# EAGLE design counter (EAGLE 9.1.0)
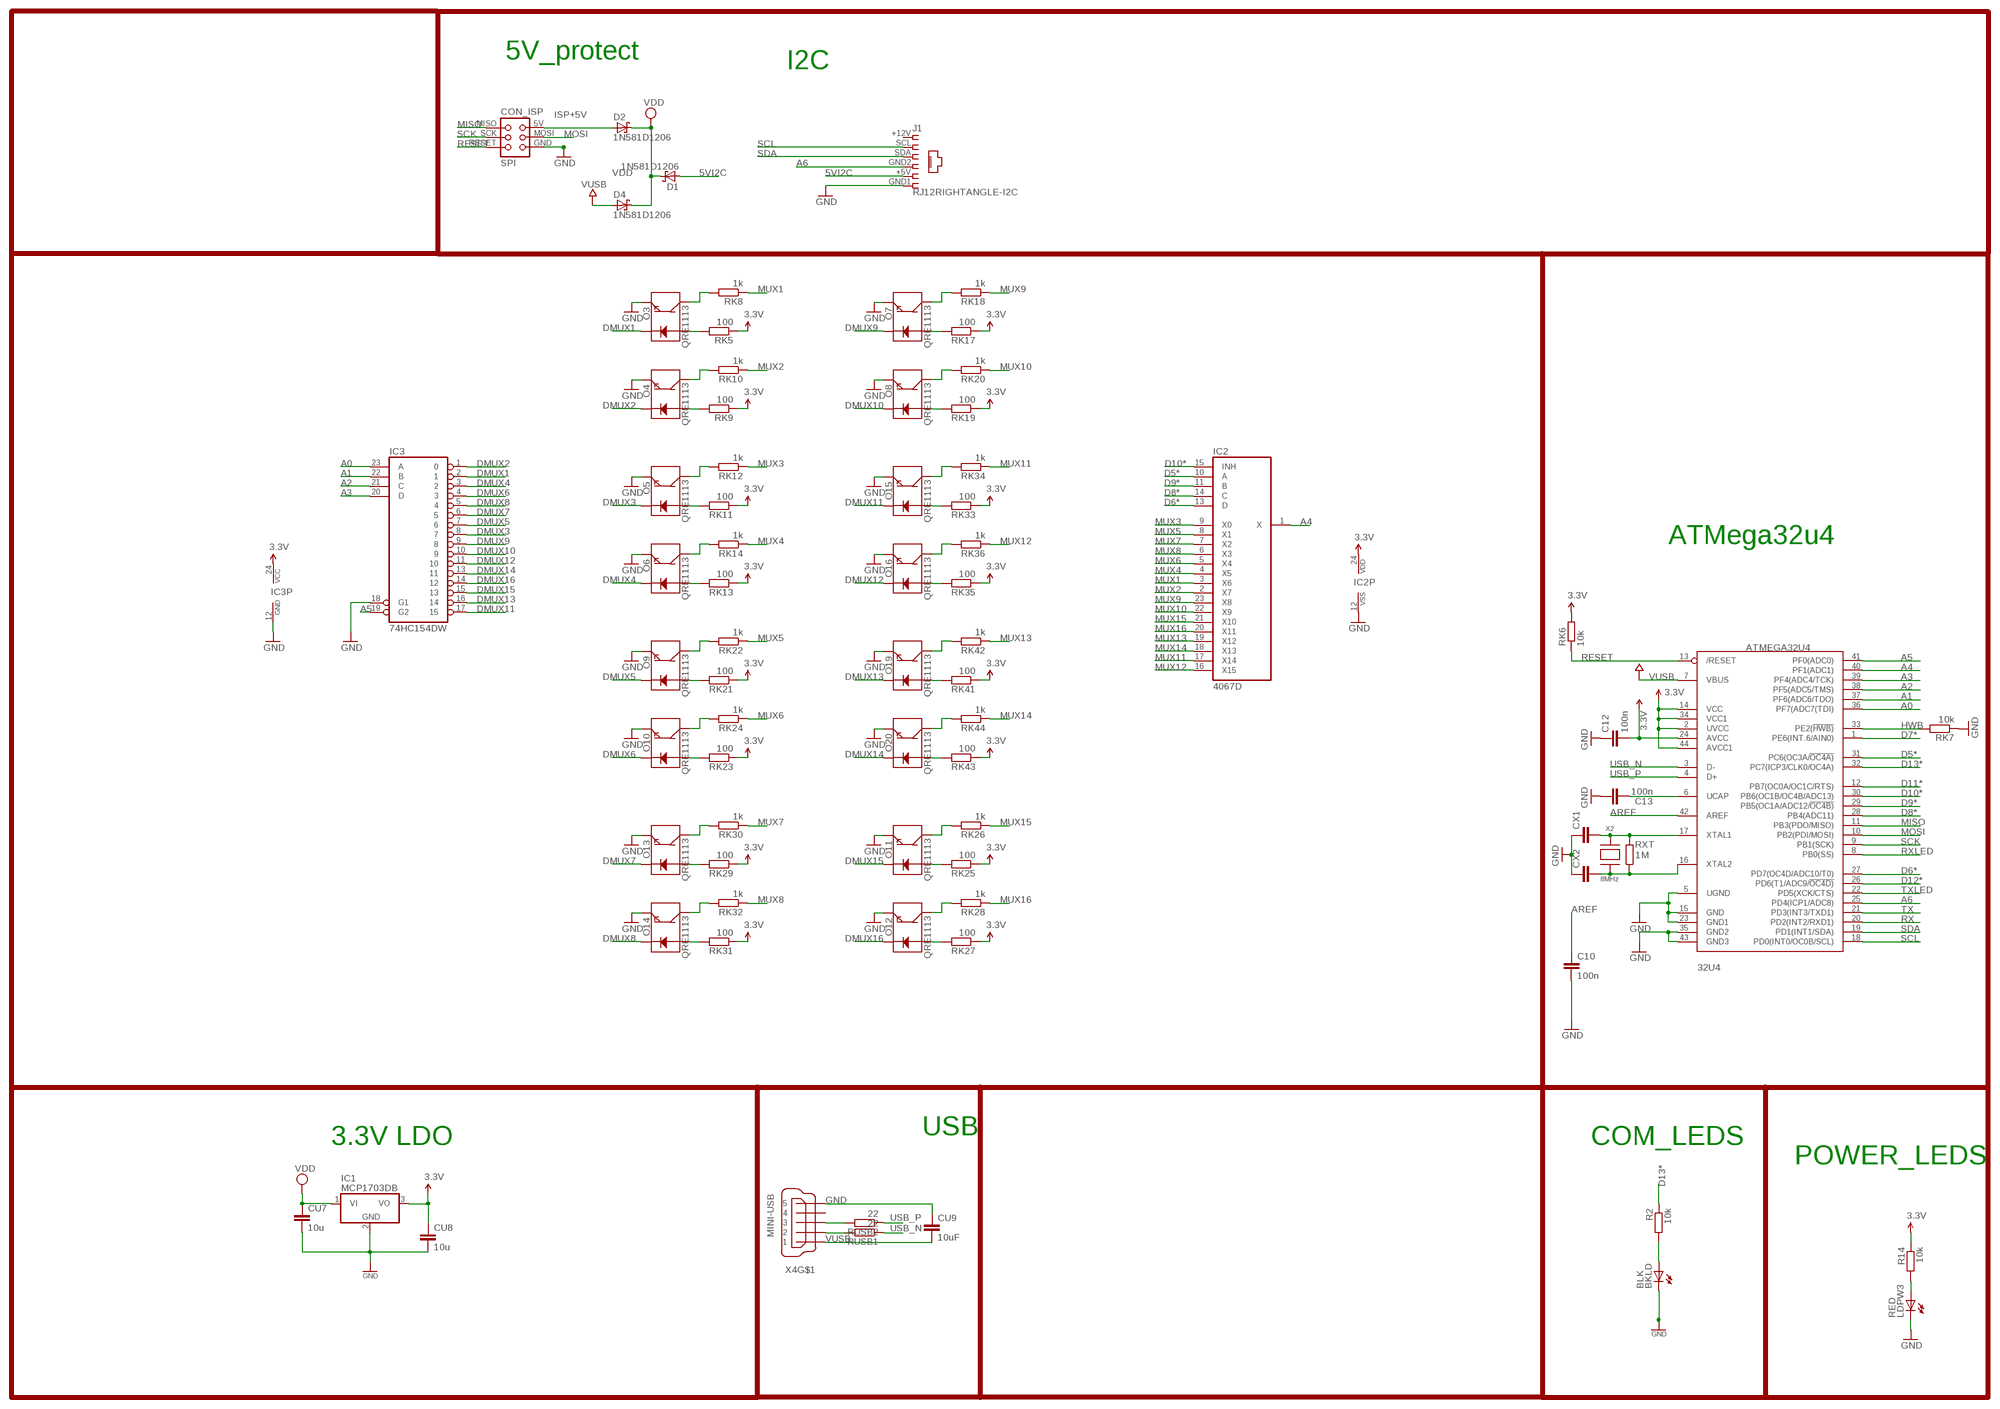
[diagram p0: schematic, sheet 1]

## Parts
32U4  ATMEGA32U4  ATMEGA32U4-AU  [TQFP44]
BKLD  BLK  LEDCHIP-LED0805  [CHIP-LED0805]
C10  100n  C-EUC0805  [C0805]
C12  100n  C-EUC0805  [C0805]
C13  100n  C-EUC0805  [C0805]
CON_ISP  SPI  TINYISPT  [TC2030-MCP-NL]
CU7  10u  C-EUC0805  [C0805]
CU8  10u  C-EUC0805  [C0805]
CU9  10uF  C-EUC0805  [C0805]
CX1  22pF  C-EUC0805  [C0805]
CX2  22pF  C-EUC0805  [C0805]
D1  1N581D1206  [LED-1206]
D2  1N581D1206  [LED-1206]
D4  1N581D1206  [LED-1206]
IC1  MCP1703DB  [SOT223]
IC2  4067D  [SO24W]
IC3  74HC154DW  [SO24W]
J1  RJ12RIGHTANGLE-I2C  [RJ12-RIGHTANGLE-I2C]
LDPW3  RED  LEDCHIP-LED0805  [CHIP-LED0805]
O3  QRE1113  [QRE1113]
O4  QRE1113  [QRE1113]
O5  QRE1113  [QRE1113]
O6  QRE1113  [QRE1113]
O7  QRE1113  [QRE1113]
O8  QRE1113  [QRE1113]
O9  QRE1113  [QRE1113]
O10  QRE1113  [QRE1113]
O11  QRE1113  [QRE1113]
O12  QRE1113  [QRE1113]
O13  QRE1113  [QRE1113]
O14  QRE1113  [QRE1113]
O15  QRE1113  [QRE1113]
O16  QRE1113  [QRE1113]
O19  QRE1113  [QRE1113]
O20  QRE1113  [QRE1113]
R2  10k  R-EU_R0805  [R0805]
R14  10k  R-EU_R0805  [R0805]
RK5  100  R-EU_M0805  [M0805]
RK6  10k  R-EU_M0805  [M0805]
RK7  10k  R-EU_M0805  [M0805]
RK8  1k  R-EU_M0805  [M0805]
RK9  100  R-EU_M0805  [M0805]
RK10  1k  R-EU_M0805  [M0805]
RK11  100  R-EU_M0805  [M0805]
RK12  1k  R-EU_M0805  [M0805]
RK13  100  R-EU_M0805  [M0805]
RK14  1k  R-EU_M0805  [M0805]
RK17  100  R-EU_M0805  [M0805]
RK18  1k  R-EU_M0805  [M0805]
RK19  100  R-EU_M0805  [M0805]
RK20  1k  R-EU_M0805  [M0805]
RK21  100  R-EU_M0805  [M0805]
RK22  1k  R-EU_M0805  [M0805]
RK23  100  R-EU_M0805  [M0805]
RK24  1k  R-EU_M0805  [M0805]
RK25  100  R-EU_M0805  [M0805]
RK26  1k  R-EU_M0805  [M0805]
RK27  100  R-EU_M0805  [M0805]
RK28  1k  R-EU_M0805  [M0805]
RK29  100  R-EU_M0805  [M0805]
RK30  1k  R-EU_M0805  [M0805]
RK31  100  R-EU_M0805  [M0805]
RK32  1k  R-EU_M0805  [M0805]
RK33  100  R-EU_M0805  [M0805]
RK34  1k  R-EU_M0805  [M0805]
RK35  100  R-EU_M0805  [M0805]
RK36  1k  R-EU_M0805  [M0805]
RK41  100  R-EU_M0805  [M0805]
RK42  1k  R-EU_M0805  [M0805]
RK43  100  R-EU_M0805  [M0805]
RK44  1k  R-EU_M0805  [M0805]
RUSB1  22  R-EU_M0805  [M0805]
RUSB2  22  R-EU_M0805  [M0805]
RXT  1M  R-EU_R0805  [R0805]
X2  8MHz  XTALNX6035  [NX6035]
X4  MINI-USB  MINI-USB-SCHIELD-32005-201  [32005-201]

## Nets
3.3V [power]: 32U4.2(UVCC) 32U4.14(VCC) 32U4.24(AVCC) 32U4.34(VCC1) 32U4.44(AVCC1) C12.2 CU8.1 IC1.3(VO) IC2.24(VDD) IC3.24(VCC) R14.1 RK5.1 RK6.2 RK9.1 RK11.1 RK13.1 RK17.1 RK19.1 RK21.1 RK23.1 RK25.1 RK27.1 RK29.1 RK31.1 RK33.1 RK35.1 RK41.1 RK43.1
5VI2C: D1.A J1.+5V
A0: 32U4.36(PF7(ADC7(TDI)) IC3.23(A)
A1: 32U4.37(PF6(ADC6/TDO)) IC3.22(B)
A2: 32U4.38(PF5(ADC5/TMS)) IC3.21(C)
A3: 32U4.39(PF4(ADC4/TCK)) IC3.20(D)
A4: 32U4.40(PF1(ADC1)) IC2.1(X)
A5: 32U4.41(PF0(ADC0)) IC3.19(G2)
A6: 32U4.25(PD4(ICP1/ADC8)) J1.GND2
AREF: 32U4.42(AREF) C10.1
D5*: 32U4.31(PC6(OC3A/!OC4A)) IC2.10(A)
D6*: 32U4.27(PD7(OC4D/ADC10/T0)) IC2.13(D)
D7*: 32U4.1(PE6(INT.6/AIN0))
D8*: 32U4.28(PB4(ADC11)) IC2.14(C)
D9*: 32U4.29(PB5(OC1A/ADC12/!OC4B)) IC2.11(B)
D10*: 32U4.30(PB6(OC1B/OC4B/ADC13)) IC2.15(INH)
D11*: 32U4.12(PB7(OC0A/OC1C/RTS))
D12*: 32U4.26(PD6(T1/ADC9/!OC4D))
D13*: 32U4.32(PC7(ICP3/CLK0/OC4A)) R2.1
DMUX1: IC3.2 O3.2(K)
DMUX2: IC3.1 O4.2(K)
DMUX3: IC3.8 O5.2(K)
DMUX4: IC3.3 O6.2(K)
DMUX5: IC3.7 O9.2(K)
DMUX6: IC3.4 O10.2(K)
DMUX7: IC3.6 O13.2(K)
DMUX8: IC3.5 O14.2(K)
DMUX9: IC3.9 O7.2(K)
DMUX10: IC3.10 O8.2(K)
DMUX11: IC3.17 O15.2(K)
DMUX12: IC3.11 O16.2(K)
DMUX13: IC3.16 O19.2(K)
DMUX14: IC3.13 O20.2(K)
DMUX15: IC3.15 O11.2(K)
DMUX16: IC3.14 O12.2(K)
GND [power]: 32U4.5(UGND) 32U4.15(GND) 32U4.23(GND1) 32U4.35(GND2) 32U4.43(GND3) BKLD.C C10.2 C12.1 C13.1 CON_ISP.GND CU7.2 CU8.2 CU9.1 CX1.1 CX2.1 IC1.2(GND) IC2.12(VSS) IC3.12(GND) IC3.18(G1) J1.GND1 LDPW3.C O3.4(E) O4.4(E) O5.4(E) O6.4(E) O7.4(E) O8.4(E) O9.4(E) O10.4(E) O11.4(E) O12.4(E) O13.4(E) O14.4(E) O15.4(E) O16.4(E) O19.4(E) O20.4(E) RK7.1 X4.5
HWB: 32U4.33(PE2(!HWB)) RK7.2
ISP+5V: CON_ISP.5V(VCC) D2.A
MISO: 32U4.11(PB3(PDO/MISO)) CON_ISP.MISO
MOSI: 32U4.10(PB2(PDI/MOSI)) CON_ISP.MOSI
MUX1: IC2.3(X6) RK8.1
MUX2: IC2.2(X7) RK10.1
MUX3: IC2.9(X0) RK12.1
MUX4: IC2.4(X5) RK14.1
MUX5: IC2.8(X1) RK22.1
MUX6: IC2.5(X4) RK24.1
MUX7: IC2.7(X2) RK30.1
MUX8: IC2.6(X3) RK32.1
MUX9: IC2.23(X8) RK18.1
MUX10: IC2.22(X9) RK20.1
MUX11: IC2.17(X14) RK34.1
MUX12: IC2.16(X15) RK36.1
MUX13: IC2.19(X12) RK42.1
MUX14: IC2.18(X13) RK44.1
MUX15: IC2.21(X10) RK26.1
MUX16: IC2.20(X11) RK28.1
N$1: 32U4.6(UCAP) C13.2
N$3: BKLD.A R2.2
N$34: LDPW3.A R14.2
N$42: 32U4.17(XTAL1) CX1.2 RXT.2 X2.P$2
RD3: O3.1(A) RK5.2
RD4: O4.1(A) RK9.2
RD5: O5.1(A) RK11.2
RD6: O6.1(A) RK13.2
RD7: O7.1(A) RK17.2
RD8: O8.1(A) RK19.2
RD9: O9.1(A) RK21.2
RD10: O10.1(A) RK23.2
RD11: O11.1(A) RK25.2
RD12: O12.1(A) RK27.2
RD13: O13.1(A) RK29.2
RD14: O14.1(A) RK31.2
RD15: O15.1(A) RK33.2
RD16: O16.1(A) RK35.2
RD19: O19.1(A) RK41.2
RD20: O20.1(A) RK43.2
RESET: 32U4.13(/RESET) CON_ISP.RESET RK6.1
RX: 32U4.20(PD2(INT2/RXD1))
RXLED: 32U4.8(PB0(SS))
SCK: 32U4.9(PB1(SCK)) CON_ISP.SCK
SCL: 32U4.18(PD0(INT0/OC0B/SCL)) J1.SCL
SDA: 32U4.19(PD1(INT1/SDA)) J1.SDA
TX: 32U4.21(PD3(INT3/TXD1))
TXLED: 32U4.22(PD5(XCK/CTS))
USB_N: 32U4.3(D-) RUSB1.1
USB_P: 32U4.4(D+) RUSB2.1
USBC_N: RUSB1.2 X4.2
USBC_P: RUSB2.2 X4.3
VDD [power]: CU7.1 D1.C D2.C D4.C IC1.1(VI)
VUSB: 32U4.7(VBUS) CU9.2 D4.A X4.1
XTAL1: 32U4.16(XTAL2) CX2.2 RXT.1 X2.P$1
Y3: O3.3(C) RK8.2
Y4: O4.3(C) RK10.2
Y5: O5.3(C) RK12.2
Y6: O6.3(C) RK14.2
Y7: O7.3(C) RK18.2
Y8: O8.3(C) RK20.2
Y9: O9.3(C) RK22.2
Y10: O10.3(C) RK24.2
Y11: O11.3(C) RK26.2
Y12: O12.3(C) RK28.2
Y13: O13.3(C) RK30.2
Y14: O14.3(C) RK32.2
Y15: O15.3(C) RK34.2
Y16: O16.3(C) RK36.2
Y19: O19.3(C) RK42.2
Y20: O20.3(C) RK44.2
Unconnected: X4.4 X4.M1(S:S1) X4.M2(S:S2) X4.M3(S:S3) X4.M4(S:S4)

## Notes on the sheet
- 5V_protect
- I2C
- ATMega32u4
- USB
- 3.3V LDO | COM_LEDS
- POWER_LEDS

## Power pins joined to a net without a drawn wire
1: J1.+12V

## Library data of the parts
32U4 = adafruit:ATMEGA32U4: http://www.ladyada.net/library/eagle
BKLD LDPW3 = adafruit:LED: LED OSRAM: - CHIPLED LG R971, LG N971, LY N971, LG Q971, LY Q971, LO R971, LY R971 LH N974, LH R974 LS Q976, LO Q976, LY Q976 LO Q996 - Hyper CHIPLED LW Q18S LB Q993, LB Q99A, LB R99A - SideLED LS A670, LO A670, LY A670, LG A670, LP A670 LB A673, LV A673, LT A673, LW A673 LH A674 LY A675 LS A676, LA A676, LO A676, LY A676, LW A676 LS A679, LY A679, LG A679 - Hyper Micro SIDELED® LS Y876, LA Y876, LO Y876, LY Y876 LT Y87S - SmartLED LW L88C, LW L88S LB L89C, LB L89S, LG L890 LS L89K, LO L89K, LY L89K LS L896, LA L896, LO L896, LY L896 - TOPLED LS T670, LO T670, LY T670, LG T670, LP T670 LSG T670, LSP T670, LSY T670, LOP T670, LYG T670 LG T671, LOG T671, LSG T671 LB T673, LV T673, LT T673, LW T673 LH T674 LS T676, LA T676, LO T676, LY T676, LB T676, LH T676, LSB T676, LW T676 LB T67C, LV T67C, LT T67C, LS T67K, LO T67K, LY T67K, LW E67C LS E67B, LA E67B, LO E67B, LY E67B, LB E67C, LV E67C, LT E67C LW T67C LS T679, LY T679, LG T679 LS T770, LO T770, LY T770, LG T770, LP T770 LB T773, LV T773, LT T773, LW T773 LH T774 LS E675, LA E675, LY E675, LS T675 LS T776, LA T776, LO T776, LY T776, LB T776 LHGB T686 LT T68C, LB T68C - Hyper Mini TOPLED® LB M676 - Mini TOPLED Santana® LG M470 LS M47K, LO M47K, LY M47K Source: http://www.osram.convergy.de/
C10 C12 C13 CU7-CU9 CX1 CX2 = rcl:C-EU: CAPACITOR, European symbol; SPICEPREFIX: C
CON_ISP = lpatiny:TINYISP: CONNECTOR
D1 D2 D4 = lpatiny:1N581*: 1.0A SCHOTTKY BARRIER RECTIFIER Source: http://www.diodes.com/datasheets/ds23001.pdf
IC1 = linear:MCP1703: 250 mA, 16V, Low Quiescent Current LDO Regulator Source: http://ww1.microchip.com/downloads/en/DeviceDoc/22049b.pdf
IC2 = 40xx:4067: 16-channel ANALOG MULTIPLEXER
IC3 = 74xx-eu:74*154: 4-line to 16-line data SELECTOR/MULTIPLEXER
J1 = lpatiny:RJ12: CORCOM Modular RJ Jacks No Shield Source: www.tycoelectronics.com .. ENG_DS_1654001_1099_RJ_L_0507.pdf
O3-O16 O19 O20 = SparkFun:QRE1113
R2 RXT = rcl:R-EU_: RESISTOR, European symbol; SPICEPREFIX: R
R14 RK5-RK14 RK17-RK36 RK41-RK44 RUSB1 RUSB2 = resistor:R-EU_: RESISTOR, European symbol
X2 = lpatiny:XTAL: Low cost SMT crystals, no capacitors included http://www.ladyada.net/library/eagle
X4 = con-cypressindustries:MINI-USB-SCHIELD-: MINI USB-B Conector Source: www.cypressindustries.com; OC_FARNELL: unknown; OC_NEWARK: unknown

## Net classes
0 default: width 0.203 mm, clearance 0.25 mm
1 power: width 0.203 mm, drill 0.305 mm, clearance 0.25 mm
2 VIN: width 0.254 mm, clearance 0.25 mm
3 fine: width 0.254 mm, clearance 0.25 mm
4 aref: width 0.254 mm, clearance 0.25 mm

## Board
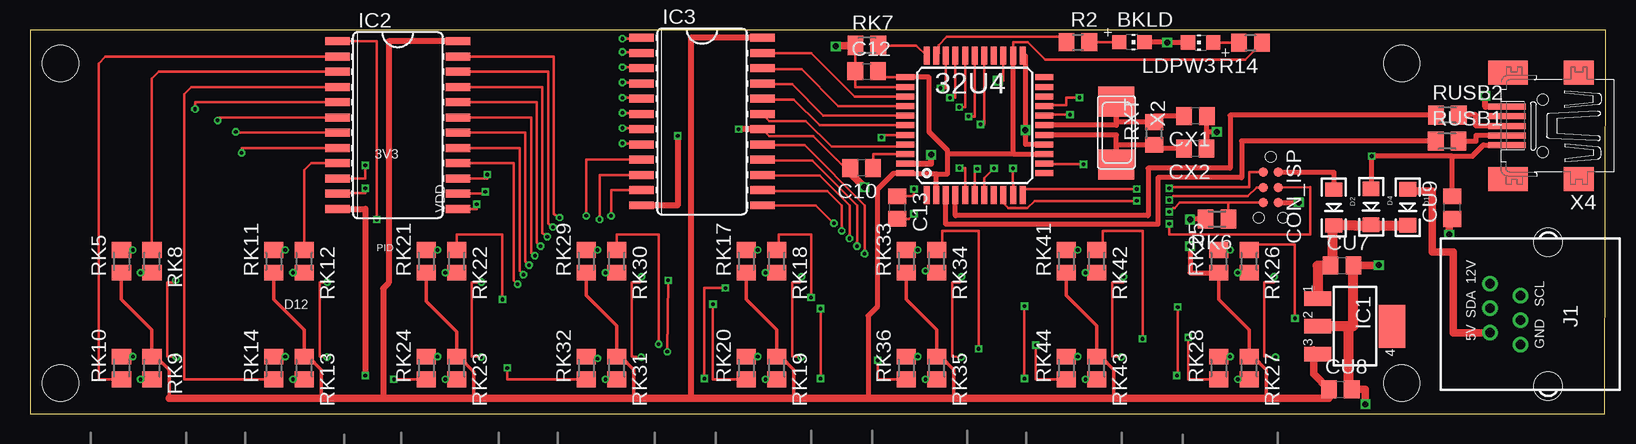
[diagram p1: board, top side]
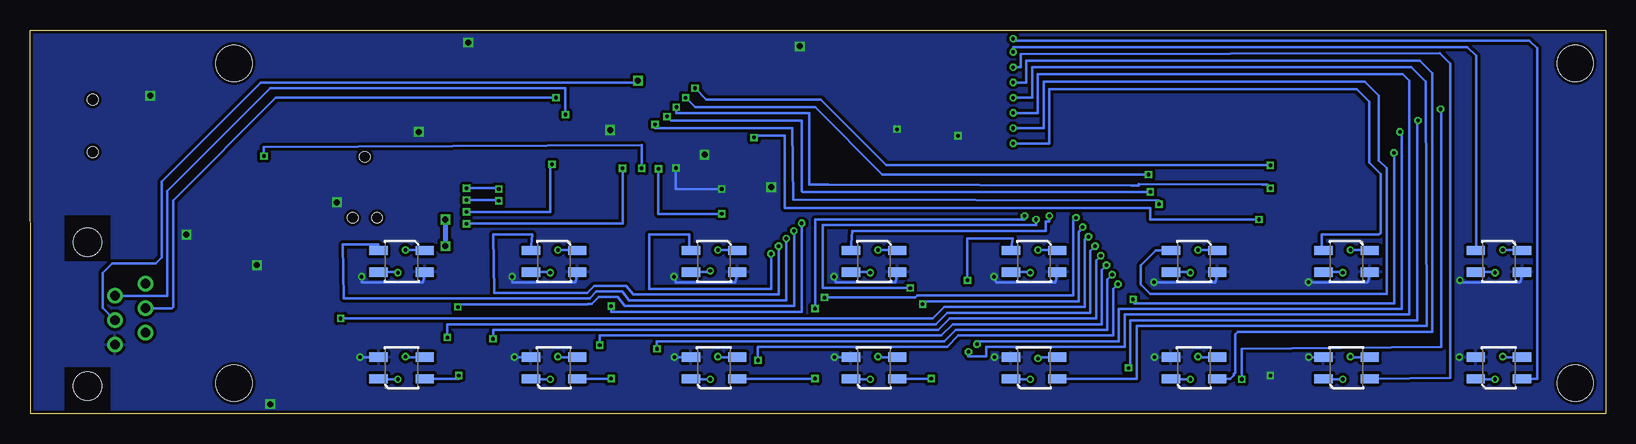
[diagram p2: board, bottom side, seen from below]

Size 131.3 x 32 mm. Coordinates in mm from the lower left corner, seen from the top.
Outline: 0,0 131.24,0 131.3,32 0,32 0,0
Copper layers (1*2*15*16): Top 0.035mm / dielectric 0.2mm / Route2 0.0175mm / dielectric 1.1mm / Route15 0.0175mm / dielectric 0.2mm / Bottom 0.035mm
Design rules "SeeedStudio_DRU_no_angle_20130527 *": minimum track width 6mil, minimum drill 0.29mm, track to track 6mil, track to pad 6mil, pad to pad 6mil, via to via 6mil, smd to smd 0mil, copper to edge 10mil, drill to drill 10mil, minimum pad ring 6mil, minimum via ring 6mil, stop-mask expansion 2mil, vias tented up to drill 25mil, thermal gap 10mil
Holes 3 mm at 2.54,29.21 2.54,2.54 114.3,29.21 114.3,2.54

### Footprints (pad centres in the part's own frame; a part is rotated, then mirrored left to right if it is on the bottom)
TQFP44 = smd 1.5 x 0.5: 1 -5.8,4; 2 -5.8,3.2; 3 -5.8,2.4; 4 -5.8,1.6; 5 -5.8,0.8; 6 -5.8,0; 7 -5.8,-0.8; 8 -5.8,-1.6; 9 -5.8,-2.4; 10 -5.8,-3.2; 11 -5.8,-4; 23 5.8,-4; 24 5.8,-3.2; 25 5.8,-2.4; 26 5.8,-1.6; 27 5.8,-0.8; 28 5.8,0; 29 5.8,0.8; 30 5.8,1.6; 31 5.8,2.4; 32 5.8,3.2; 33 5.8,4 | smd 0.5 x 1.5: 12 -4,-5.8; 13 -3.2,-5.8; 14 -2.4,-5.8; 15 -1.6,-5.8; 16 -0.8,-5.8; 17 0,-5.8; 18 0.8,-5.8; 19 1.6,-5.8; 20 2.4,-5.8; 21 3.2,-5.8; 22 4,-5.8; 34 4,5.8; 35 3.2,5.8; 36 2.4,5.8; 37 1.6,5.8; 38 0.8,5.8; 39 0,5.8; 40 -0.8,5.8; 41 -1.6,5.8; 42 -2.4,5.8; 43 -3.2,5.8; 44 -4,5.8
CHIP-LED0805 = smd 1.2 x 1.2: A 0,-1.05; C 0,1.05
C0805 = smd 1.3 x 1.5: 1 -0.95,0; 2 0.95,0
TC2030-MCP-NL = smd 0.787 x 0.787: 5V 1.27,0.635; GND 3.81,0.635; MISO 1.27,-0.635; MOSI 2.54,0.635; RESET 3.81,-0.635; SCK 2.54,-0.635 | hole 0.889: 0,0; 5.08,-1.016; 5.08,1.016
LED-1206 = smd 1.2 x 1.4: A -1.5,0; C 1.5,0
SOT223 = smd 1.219 x 2.235: 1 -2.311,-3.099; 2 0,-3.099; 3 2.311,-3.099 | smd 3.6 x 2.2: 4 0,3.099
SO24W = smd 0.66 x 2.032: 1 -6.985,-5.029; 2 -5.715,-5.029; 3 -4.445,-5.029; 4 -3.175,-5.029; 5 -1.905,-5.029; 6 -0.635,-5.029; 7 0.635,-5.029; 8 1.905,-5.029; 9 3.175,-5.029; 10 4.445,-5.029; 11 5.715,-5.029; 12 6.985,-5.029; 13 6.985,5.029; 14 5.715,5.029; 15 4.445,5.029; 16 3.175,5.029; 17 1.905,5.029; 18 0.635,5.029; 19 -0.635,5.029; 20 -1.905,5.029; 21 -3.175,5.029; 22 -4.445,5.029; 23 -5.715,5.029; 24 -6.985,5.029
RJ12-RIGHTANGLE-I2C = drill 0.8 pad 1.3: +5V -1.54,4.84; +12V 2.54,4.84; GND1 -2.54,2.3; GND2 -0.5,2.3; SCL 1.54,2.3; SDA 0.5,4.84 | hole 2.36: -6,0; 6,0
QRE1113 = smd 1.524 x 0.762: 1 -1.927,-0.9; 2 1.927,-0.9; 3 1.927,0.9; 4 -1.927,0.9
R0805 = smd 1.3 x 1.5: 1 -0.95,0; 2 0.95,0
M0805 = smd 1.3 x 1.6: 1 -0.95,0; 2 0.95,0
NX6035 = smd 2.5 x 3: P$1 2.665,0; P$2 -2.565,0
32005-201 = smd 3.1 x 0.5: 1 3,1.6; 2 3,0.8; 3 3,0; 4 3,-0.8; 5 3,-1.6 | smd 2.5 x 2: M1 -3,-4.45; M2 -3,4.45 | smd 3.3 x 2: M3 2.9,4.45; M4 2.9,-4.45 | hole 0.9: 0,2.2; 0,-2.2

### Placement (x,y rotation side)
32U4  78.72,24.05 90 top
BKLD  91.82,30.98 270 top
C10  69.31,20.49 180 top
C12  69.72,28.55 0 top
C13  72.25,17.19 270 top
CON_ISP  103.4,21.42 270 top
CU7  109.33,12.36 0 top
CU8  109.19,2.03 0 top
CU9  118.53,17.18 90 top
CX1  97.12,24.82 180 top
CX2  97.11,22.09 180 top
D1  114.8,17.21 270 top
D2  108.65,17.19 270 top
D4  111.76,17.25 270 top
IC1  110.4,7.28 270 top
IC2  30.65,24.07 270 top
IC3  56,24.36 270 top
J1  126.52,8.29 90 top
LDPW3  97.56,30.95 90 top
O3  8.89,12.7 180 bottom
O4  8.89,3.81 0 bottom
O5  21.59,12.7 180 bottom
O6  21.59,3.81 0 bottom
O7  60.96,12.7 180 bottom
O8  60.96,3.81 0 bottom
O9  34.29,12.7 180 bottom
O10  34.29,3.81 0 bottom
O11  100.33,12.7 180 bottom
O12  100.33,3.81 0 bottom
O13  47.62,12.7 180 bottom
O14  47.62,3.81 0 bottom
O15  74.3,12.7 180 bottom
O16  74.3,3.81 0 bottom
O19  87.63,12.7 180 bottom
O20  87.63,3.81 0 bottom
R2  87.32,30.99 0 top
R14  101.71,30.93 180 top
RK5  7.62,12.7 90 top
RK6  98.92,16.23 180 top
RK7  69.74,30.71 0 top
RK8  10.16,12.7 270 top
RK9  10.16,3.81 270 top
RK10  7.62,3.81 90 top
RK11  20.32,12.7 90 top
RK12  22.86,12.7 270 top
RK13  22.86,3.81 270 top
RK14  20.32,3.81 90 top
RK17  59.69,12.7 90 top
RK18  62.23,12.7 270 top
RK19  62.23,3.81 270 top
RK20  59.69,3.81 90 top
RK21  33.02,12.7 90 top
RK22  35.56,12.7 270 top
RK23  35.56,3.81 270 top
RK24  33.02,3.81 90 top
RK25  99.06,12.7 90 top
RK26  101.6,12.7 270 top
RK27  101.6,3.81 270 top
RK28  99.06,3.81 90 top
RK29  46.35,12.7 90 top
RK30  48.89,12.7 270 top
RK31  48.89,3.81 270 top
RK32  46.35,3.81 90 top
RK33  73.02,12.7 90 top
RK34  75.56,12.7 270 top
RK35  75.56,3.81 270 top
RK36  73.02,3.81 90 top
RK41  86.36,12.7 90 top
RK42  88.9,12.7 270 top
RK43  88.9,3.81 270 top
RK44  86.36,3.81 90 top
RUSB1  118.1,22.73 0 top
RUSB2  118.11,24.89 0 top
RXT  93.69,23.37 90 top
X2  90.53,23.45 270 top
X4  126.08,24 180 top

### Tracks (layer width: path | path; a pad name or v marks a point on that pad's centre or on a via)
3.3V  (via drill 0.5)
  Top 0.203: 32U4.34 70.67,28.05 C12.2 | 32U4.24 81.92,30.98 83.16,30.98 84.61,29.53 101.25,29.53 R14.1
  Top 0.305: RK29.1 46.35,9.85 48.89,7.3 RK31.1 49.21,4.76 50.32,3.65 50.32,1.48 50.53,1.27 | RK41.1 86.36,9.85 88.9,7.3 RK43.1 89.22,4.76 90.33,3.65 90.33,1.37 90.43,1.27 | RK25.1 99.06,11.7 99.06,9.53 101.6,6.99 RK27.1 101.92,4.76 103.03,3.65 103.03,1.31 102.98,1.27 | 11.59,1.27 11.59,1.28 11.59,3.65 10.48,4.76 RK9.1 10.16,6.99 7.62,9.53 RK5.1 | 24.34,1.27 24.29,1.32 24.29,3.65 23.18,4.76 RK13.1 22.86,6.99 20.32,9.53 RK11.1 | 37.25,1.27 36.99,1.53 36.99,3.49 35.72,4.76 RK23.1 35.56,6.83 33.02,9.37 RK21.1 | 63.61,1.27 63.66,1.32 63.66,3.65 62.55,4.76 RK19.1 62.23,6.99 59.69,9.53 RK17.1 | 76.98,1.27 76.99,1.28 76.99,3.65 75.89,4.76 RK35.1 75.56,6.99 73.02,9.53 RK33.1
  Top 0.406: 32U4.2 75.52,20 | 81.92,21.65 76.48,21.65 | 81.92,21.65 32U4.14 | 81.92,21.65 32U4.24 | 32U4.34 74.93,28.05 74.93,23.5 76.48,21.95 76.48,21.65 | 75.52,20 72.92,20 32U4.44 71.96,20.05 70.64,18.73 70.64,8.95 69.85,8.16 69.85,1.27 | 75.52,20 76.48,20 76.48,21.65 | RK6.2 96.72,16.23 v96.68,16.19 | v96.68,13.97 96.68,11.75 99.01,11.75 99.06,11.7
  Top 0.508: IC3.24 55.07,31.35 55.07,1.27 | IC2.24 29.89,31.05 29.89,10.92 29.42,10.44 29.42,1.27
  Top 0.61: 11.59,1.27 24.34,1.27 29.42,1.27 37.25,1.27 50.53,1.27 55.07,1.27 63.61,1.27 69.85,1.27 76.98,1.27 90.43,1.27 102.98,1.27 108.25,1.27 CU8.1 106.97,3.3 106.97,5.3 IC1.3
  Bottom 0.406: v96.68,16.19 v96.68,13.97
5VI2C
  Top 0.61: J1.+5V 118.59,6.75 118.59,13.49 116.84,13.49 116.84,18.57 114.8,18.57 D1.A
A0
  Top 0.203: IC3.23 65.09,30.08 68.71,26.45 32U4.36
A1
  Top 0.203: IC3.22 61.1,28.73 64.29,28.73 67.38,25.65 32U4.37
A2
  Top 0.203: IC3.21 61.1,27.46 63.5,27.46 66.11,24.85 32U4.38
A3
  Top 0.203: IC3.20 61.1,26.19 63.66,26.19 65.8,24.05 32U4.39
A4  (via drill 0.3)
  Top 0.203: IC2.1 28.89,31.05 v28.89,16.19 | 32U4.40 70.96,23.25 v70.96,23.03
  Bottom 0.203: v28.89,16.19 37.94,16.19 37.94,17.14 68.42,17.14 68.42,23.18 70.96,23.18 v70.96,23.03
A5
  Top 0.203: IC3.19 61.62,24.41 64.66,24.41 66.82,22.25 72.39,22.25 72.59,22.45 32U4.41
A6  (via drill 0.5)
  Top 0.203: v80.64,27.78 81.12,27.78 32U4.25
  Bottom 0.203: v80.64,27.78 80.64,27.62 112.08,27.62 120.33,19.37 120.33,13.02 120.81,12.54 124.46,12.54 125.25,11.75 125.25,8.82 J1.GND2
AREF
  Top 0.203: 32U4.42 70.26,21.65 C10.1
D5*  (via drill 0.3)
  Top 0.203: IC2.10 27.94,19.62 v27.94,20.72 | v75.88,27.15 76.32,27.15 32U4.31
  Bottom 0.203: v75.88,27.15 74.93,26.19 65.41,26.19 59.93,20.72 v27.94,20.72
D6*  (via drill 0.3)
  Top 0.203: IC2.13 37.23,17.08 v37.23,17.46 | v79.22,24.13 79.52,24.13 32U4.27
  Bottom 0.203: v37.23,17.46 37.23,17.78 67.71,17.86 67.79,23.81 79.22,23.81 v79.22,24.13
D8*  (via drill 0.3)
  Top 0.203: IC2.14 37.94,18.35 v37.94,18.49 | v78.22,24.79 78.72,24.79 32U4.28
  Bottom 0.203: v78.22,24.79 77.88,24.45 66.99,24.45 66.99,18.57 66.91,18.49 v37.94,18.49
D9*  (via drill 0.3)
  Top 0.203: IC2.11 25.62,18.41 27.94,18.41 v27.94,18.8 | v77.44,25.57 77.92,25.57 32U4.29
  Bottom 0.203: v77.44,25.57 77.44,25.08 66.36,25.08 66.36,19.12 64.77,19.12 39.52,19.01 38.91,19.01 38.91,19.17 28.62,19.12 28.21,19.12 v27.94,18.8
D10*  (via drill 0.3)
  Top 0.203: v76.66,26.35 77.12,26.35 32U4.30 | IC2.15 38.1,19.62 v38.1,19.94
  Bottom 0.203: v76.66,26.35 75.87,25.56 65.88,25.56 60.26,19.94 v38.1,19.94
D13*
  Top 0.203: 32U4.32 75.72,30.05 75.72,30.75 76.41,31.43 85.92,31.43 R2.1
DMUX1  (via drill 0.3)
  Top 0.203: v49.37,30.16 50.97,30.16 IC3.2
  Bottom 0.203: O3.2 10.79,13.6 10.79,29.84 11.51,30.56 49.37,30.56 v49.37,30.16
DMUX2  (via drill 0.3)
  Top 0.203: v49.37,31.27 50.97,31.27 IC3.1
  Bottom 0.203: O4.2 5.71,2.91 5.71,30.48 6.35,31.11 49.37,31.11 v49.37,31.27
DMUX3  (via drill 0.3)
  Top 0.203: v49.37,22.54 50.97,22.54 IC3.8
  Bottom 0.203: v49.37,22.54 46.35,22.54 46.35,27.07 20.72,27.07 19.69,26.04 19.69,20.95 18.73,20 18.73,15.08 18.89,14.92 23.65,14.92 23.65,13.74 O5.2
DMUX4  (via drill 0.3)
  Top 0.203: v49.37,28.89 50.97,28.89 IC3.3
  Bottom 0.203: O6.2 12.94,2.99 12.94,29.21 13.81,30.08 48.72,30 48.72,29.89 48.74,29.87 48.74,28.89 v49.37,28.89
DMUX5  (via drill 0.3)
  Top 0.203: v49.37,23.81 50.97,23.81 IC3.7
  Bottom 0.203: v49.37,23.81 46.83,23.81 46.83,27.7 20.08,27.7 18.89,26.51 18.89,21.11 18.26,20.48 18.26,10 37.94,10 38.73,10.79 38.73,12.35 37.49,13.6 O9.2
DMUX6  (via drill 0.3)
  Top 0.203: v49.37,27.62 50.97,27.62 IC3.4
  Bottom 0.203: O10.2 31.27,2.91 30.98,3.21 30.98,3.31 30.88,3.4 30.88,6.59 30.64,6.83 14.45,6.83 14.45,28.42 15.48,29.45 48.26,29.45 48.26,27.62 v49.37,27.62
DMUX7  (via drill 0.3)
  Top 0.203: v53.18,11.11 v53.1,5.16 | v49.37,25.08 50.97,25.08 IC3.6
  Bottom 0.203: v53.18,11.11 53.18,14.61 49.42,14.61 O13.2 | v49.37,25.08 47.31,25.08 47.31,28.34 16.91,28.34 16.35,27.78 16.35,8.26 40.08,8.26 40.08,5.56 51.59,5.56 51.59,4.76 53.1,4.76 v53.1,5.16
DMUX8  (via drill 0.3)
  Top 0.203: v49.37,26.35 50.97,26.35 IC3.5
  Bottom 0.203: O14.2 39.05,2.91 39.05,7.3 14.92,7.3 15,27.7 16.2,28.89 47.78,28.89 47.78,26.35 v49.37,26.35
DMUX9  (via drill 0.3)
  Top 0.203: IC3.9 46.35,21.19 v46.35,16.49
  Bottom 0.203: O7.2 62.76,15.24 46.67,15.24 46.67,16.03 46.35,16.03 v46.35,16.49
DMUX10  (via drill 0.3)
  Top 0.203: v56.2,2.91 56.2,10.48 v57.94,10.48 | v47.47,16.19 47.47,19.92 IC3.10
  Bottom 0.203: v57.94,10.48 65.25,10.48 65.25,15.72 47.47,15.72 v47.47,16.19 | O8.2 v56.2,2.91
DMUX11  (via drill 0.3)
  Top 0.203: v69.55,13.34 69.55,13.68 69.57,13.7 69.57,17.36 64.55,22.38 61.1,22.38 IC3.17
  Bottom 0.203: O15.2 76.36,13.6 76.36,14.92 79.69,14.92 79.69,10.4 69.53,10.4 69.53,13.34 v69.55,13.34
DMUX12  (via drill 0.3)
  Top 0.203: v65.88,2.91 v65.88,8.74 | IC3.11 48.42,18.65 v48.42,16.49
  Bottom 0.203: O16.2 v65.88,2.91 | v65.88,8.74 65.88,16.19 48.42,16.19 v48.42,16.49
DMUX13  (via drill 0.3)
  Top 0.203: v68.92,13.97 68.92,14.31 68.94,14.33 68.94,17.36 65.18,21.11 61.1,21.11 IC3.16
  Bottom 0.203: O19.2 89.43,14.92 92.71,14.92 92.63,10.08 84.85,10.08 84.3,10.64 81.61,10.64 81.05,9.92 68.9,9.92 68.9,13.97 v68.92,13.97
DMUX14  (via drill 0.3)
  Top 0.203: v82.87,8.97 v82.87,2.91 | v66.99,15.88 65.49,17.38 IC3.13
  Bottom 0.203: v82.87,8.97 82.87,8.49 66.99,8.49 v66.99,15.88 | O20.2 v82.87,2.91
DMUX15  (via drill 0.3)
  Top 0.203: v68.28,14.61 68.28,14.95 68.3,14.97 68.3,17.35 65.81,19.84 61.1,19.84 IC3.15
  Bottom 0.203: O11.2 102.29,14.13 105.25,14.13 105.17,9.6 84.82,9.6 84.79,9.63 84.66,9.63 84.11,10.18 81.95,10.18 81.39,9.47 81.39,9.45 68.26,9.45 68.26,14.61 v68.28,14.61
DMUX16  (via drill 0.3)
  Top 0.203: v95.65,8.89 95.65,3.25 v95.57,3.17 | v67.65,15.24 67.65,17.36 66.44,18.57 61.1,18.57 IC3.14
  Bottom 0.203: v95.57,3.17 95.57,2.91 O12.2 | v95.65,8.89 95.65,9.13 84.82,9.13 84.79,9.15 84.5,9.15 83.92,9.73 82.32,9.73 81.72,8.97 67.63,8.97 67.63,15.24 v67.65,15.24
GND  (via drill 0.3, 0.5)
  Top 0.203: v12.14,11.11 12.07,10.95 11.43,10.95 11.43,4.76 11.51,4.76 v12.2,4.71 | v24.77,10.95 24.13,10.95 24.13,4.76 24.21,4.76 v24.74,4.71 | v37.62,10.95 36.83,10.95 36.83,4.76 36.91,4.76 v37.6,4.71 | v50.96,11.43 50.8,10.95 50.16,10.95 50.16,4.76 50.25,4.76 v50.93,4.71 | v64.29,11.43 64.14,10.95 63.5,10.95 63.5,4.76 63.58,4.76 v64.27,4.71 | v77.63,11.43 77.47,10.95 76.83,10.95 76.83,4.76 76.92,4.76 v77.6,4.71 | v91.12,11.43 91.12,10.95 90.17,10.95 90.17,4.76 90.25,4.76 v90.94,4.71 | v103.66,11.43 103.66,10.95 102.87,10.95 102.87,4.76 102.95,4.76 v103.8,4.71 | RK7.1 68.79,28.07 68.78,28.44 | 68.78,28.44 C12.1 | 32U4.35 68.78,27.25 68.78,28.44 | IC3.18 61.62,23.14 65.29,23.14 67.94,20.49 C10.2 | C13.1 73.66,18.14 v73.66,18.73 | v77.47,20.48 77.92,20.48 32U4.5
  Top 0.406: CX1.1 98.06,24.82 98.06,23.5 | 98.06,23.5 CX2.1 | 32U4.15 82.95,22.45 v82.95,23.65 82.95,29.85 32U4.23 | BKLD.C 94.77,30.98 v94.77,30.96 94.77,30.95 LDPW3.C | CON_ISP.GND 105.71,17.61 v105.73,17.62 | v98.9,23.5 98.06,23.5
  Top 0.508: IC3.12 53.98,17.38 v53.98,23.18 | IC2.12 27.94,17.08 v27.94,3.17 | IC3.18 v59.05,23.73 | 32U4.43 75.09,20.85 v75.09,21.59 | X4.5 121.28,25.6 v121.28,26.51
  Top 0.61: RK7.1 67.15,30.71 v67.15,30.64 | CU8.2 111.12,2.03 | 111.12,2.03 111.28,2.03 v111.28,0.79 | CU7.2 112.39,12.36 v112.39,12.38 | CU9.1 118.27,16.23 v118.27,14.92 | v69.53,18.89 68.36,20.07 C10.2 | 109.86,2.03 111.12,2.03
  Top 0.813: 109.86,7.28 110.28,7.28 CU7.2 | 109.86,7.28 IC1.2 | 109.86,7.28 109.86,2.03
  Bottom 0.203: O3.4 7.09,11.01 7.14,10.95 12.07,10.95 v12.14,11.11 | O5.4 19.79,11.01 19.84,10.95 v24.77,10.95 | v24.74,4.71 O6.4 | O9.4 32.49,11.01 32.54,10.95 v37.62,10.95 | O13.4 45.82,11.01 45.88,10.95 50.8,10.95 v50.96,11.43 | O7.4 59.16,11.01 59.21,10.95 64.14,10.95 v64.29,11.43 | v64.27,4.71 O8.4 | O15.4 72.5,11.17 72.55,10.95 77.47,10.95 v77.63,11.43 | v77.6,4.71 O16.4 | O19.4 85.83,11.01 85.88,10.95 91.12,10.95 v91.12,11.43 | v90.94,4.71 O20.4 | O11.4 98.53,11.01 98.58,10.95 103.66,10.95 v103.66,11.43 | v103.8,4.71 O12.4 | v73.66,18.73 77.47,18.73 v77.47,20.48
  pour Bottom: 0,32.07 0,0 131.29,0 131.29,32.07 5.24,32.07
HWB
  Top 0.203: 32U4.33 73.87,30.71 RK7.2
ISP+5V
  Top 0.406: CON_ISP.5V 108.65,20.15 D2.A
MISO  (via drill 0.3)
  Top 0.203: CON_ISP.MISO 101.6,20.15 101.6,20.16 101.6,18.89 94.93,18.89 v94.93,18.8 | v92.23,18.73 82.72,18.73 32U4.11
  Bottom 0.203: v94.93,18.8 92.23,18.8 v92.23,18.73
MOSI  (via drill 0.3)
  Top 0.203: CON_ISP.MOSI 106.68,18.89 106.68,14.92 94.93,14.92 v94.93,15.84 | v81.91,20.45 32U4.10
  Bottom 0.203: v94.93,15.84 81.91,15.88 v81.91,20.45
MUX1
  Top 0.203: IC2.3 10.73,28.51 10.16,27.94 RK8.1
MUX2
  Top 0.203: IC2.2 6.29,29.78 5.71,29.21 5.71,2.86 RK10.1
MUX3
  Top 0.203: RK12.1 22.86,20.32 23.43,20.89 IC2.9
MUX4
  Top 0.203: IC2.4 13.43,27.24 12.86,26.67 12.86,2.86 16.77,2.86 RK14.1
MUX5  (via drill 0.3)
  Top 0.203: v39.37,9.53 39.37,14.92 35.56,14.92 RK22.1 | v17.64,21.75 17.64,22.16 IC2.8
  Bottom 0.203: v39.37,9.53 39.29,9.21 17.62,9.21 17.62,21.75 v17.64,21.75
MUX6  (via drill 0.3)
  Top 0.203: v30.32,2.86 30.75,2.86 RK24.1 | v13.75,25.4 13.75,25.97 IC2.5
  Bottom 0.203: v30.32,2.86 30.32,5.4 13.71,5.56 13.71,25.4 v13.75,25.4
MUX7  (via drill 0.3)
  Top 0.203: v52.39,5.79 52.39,14.92 48.89,14.92 RK30.1 | v17.14,23.5 17.14,23.43 IC2.7
  Bottom 0.203: v52.39,5.79 52.39,6.03 40.56,6.03 40.56,8.73 16.99,8.73 16.99,23.5 v17.14,23.5
MUX8  (via drill 0.3)
  Top 0.203: v39.77,3.81 39.77,2.86 RK32.1 | v15.64,24.45 15.64,24.7 IC2.6
  Bottom 0.203: v39.77,3.81 39.61,3.81 39.61,7.78 15.72,7.78 15.72,24.45 v15.64,24.45
MUX9  (via drill 0.3)
  Top 0.203: v65.09,9.68 65.09,14.92 62.39,14.92 62.39,13.65 RK18.1 | v44.13,16.35 43.66,16.67 43.66,19 43.66,26.99 43.66,29.78 IC2.23
  Bottom 0.203: v44.13,16.35 44.37,16.11 44.37,9.84 57.35,9.84 57.51,9.68 v65.09,9.68
MUX10  (via drill 0.3)
  Top 0.203: v56.91,9.13 56.91,2.86 RK20.1 | v43.58,15.56 43.18,15.88 43.18,28.51 IC2.22
  Bottom 0.203: v56.91,9.13 56.91,9.37 43.89,9.37 43.89,15.16 v43.58,15.56
MUX11  (via drill 0.3)
  Top 0.203: v79.06,5.4 79.06,15.24 76.04,15.24 76.04,13.65 RK34.1 | v41.12,11.59 40.8,11.91 40.8,19.11 40.8,19.21 40.8,22.16 IC2.17
  Bottom 0.203: v79.06,5.4 79.06,6.03 55.12,6.03 54.17,6.99 41.51,6.99 41.51,11.19 v41.12,11.59
MUX12  (via drill 0.3)
  Top 0.203: v70.64,4.45 70.64,2.86 RK36.1 | v40.64,10.79 40.32,11.11 40.32,20.89 IC2.16
  Bottom 0.203: v70.64,4.45 70.64,5.56 54.88,5.56 53.93,6.51 41.04,6.51 41.04,10.4 v40.64,10.79
MUX13  (via drill 0.3)
  Top 0.203: v92.71,6.23 92.71,15.24 89.38,15.24 89.38,13.65 RK42.1 | v42.07,13.18 41.75,13.41 41.75,24.7 IC2.19
  Bottom 0.203: v92.71,6.23 92.71,6.99 55.6,6.99 54.64,7.94 42.47,7.94 42.47,12.78 v42.07,13.18
MUX14  (via drill 0.3)
  Top 0.203: v83.82,5.71 83.82,2.86 RK44.1 | v41.59,12.38 41.27,12.7 41.27,19.2 41.27,23.43 IC2.18
  Bottom 0.203: v83.82,5.71 83.82,6.51 55.36,6.51 54.41,7.46 41.99,7.46 41.99,11.99 v41.59,12.38
MUX15  (via drill 0.3)
  Top 0.203: v105.41,7.94 105.41,14.13 102.23,14.13 102.23,13.65 RK26.1 | v43.1,14.76 42.7,15.08 42.7,18.89 42.7,21.43 42.7,27.24 IC2.21
  Bottom 0.203: v105.41,7.94 56.07,7.94 55.12,8.89 43.42,8.89 43.42,14.53 v43.1,14.76
MUX16  (via drill 0.3)
  Top 0.203: v42.55,13.97 42.23,14.29 42.23,25.97 IC2.20 | RK28.1 96.52,2.86 96.52,6.03 v96.52,6.35
  Bottom 0.203: v42.55,13.97 42.94,13.57 42.94,8.41 54.88,8.41 55.84,7.46 96.52,7.46 96.52,6.67 v96.52,6.35
N$1  (via drill 0.3)
  Top 0.203: C13.2 73.23,16.24 v73.66,16.67 | v78.93,20.43 78.72,20.43 32U4.6
  Bottom 0.203: v73.66,16.67 78.93,16.67 v78.93,20.43
N$3
  Top 0.203: R2.2 BKLD.A
N$34
  Top 0.203: R14.2 98.61,30.93 LDPW3.A
N$42
  Top 0.406: 32U4.17 90.53,24.05 X2.P$2 90.53,24.32 RXT.2 93.69,24.82 CX1.2
RD3  (via drill 0.3)
  Top 0.203: RK5.2 v8.57,13.65
  Bottom 0.203: v8.57,13.65 7.09,13.65 O3.1
RD4  (via drill 0.3)
  Top 0.203: RK9.2 v9.21,2.86
  Bottom 0.203: v9.21,2.86 10.69,2.86 O4.1
RD5  (via drill 0.3)
  Top 0.203: RK11.2 v21.27,13.65
  Bottom 0.203: v21.27,13.65 19.79,13.65 O5.1
RD6  (via drill 0.3)
  Top 0.203: RK13.2 v21.91,2.86
  Bottom 0.203: v21.91,2.86 23.39,2.86 O6.1
RD7  (via drill 0.3)
  Top 0.203: RK17.2 v60.64,13.65
  Bottom 0.203: v60.64,13.65 59.16,13.65 O7.1
RD8  (via drill 0.3)
  Top 0.203: RK19.2 v61.28,2.86
  Bottom 0.203: v61.28,2.86 62.76,2.86 O8.1
RD9  (via drill 0.3)
  Top 0.203: RK21.2 v33.97,13.65
  Bottom 0.203: v33.97,13.65 32.49,13.65 O9.1
RD10  (via drill 0.3)
  Top 0.203: RK23.2 v34.61,2.86
  Bottom 0.203: v34.61,2.86 36.09,2.86 O10.1
RD11  (via drill 0.3)
  Top 0.203: RK25.2 v100.01,13.65
  Bottom 0.203: v100.01,13.65 98.53,13.65 O11.1
RD12  (via drill 0.3)
  Top 0.203: RK27.2 v100.65,2.86
  Bottom 0.203: v100.65,2.86 102.13,2.86 O12.1
RD13  (via drill 0.3)
  Top 0.203: RK29.2 v47.31,13.65
  Bottom 0.203: v47.31,13.65 45.82,13.65 O13.1
RD14  (via drill 0.3)
  Top 0.203: RK31.2 v47.94,2.86
  Bottom 0.203: v47.94,2.86 49.42,2.86 O14.1
RD15  (via drill 0.3)
  Top 0.203: RK33.2 v73.98,13.65
  Bottom 0.203: v73.98,13.65 72.5,13.65 O15.1
RD16  (via drill 0.3)
  Top 0.203: RK35.2 v74.61,2.86
  Bottom 0.203: v74.61,2.86 76.09,2.86 O16.1
RD19  (via drill 0.3)
  Top 0.203: RK41.2 v87.31,13.65
  Bottom 0.203: v87.31,13.65 85.83,13.65 O19.1
RD20  (via drill 0.3)
  Top 0.203: RK43.2 v87.95,2.86
  Bottom 0.203: v87.95,2.86 89.43,2.86 O20.1
RESET  (via drill 0.3)
  Top 0.203: 99.94,17.61 CON_ISP.RESET | 99.94,17.61 95.83,17.61 95.38,17.16 95.26,17.16 v94.93,16.83 | v87.79,20.8 84.52,20.8 32U4.13 | RK6.1 99.87,17.54 99.94,17.61
  Bottom 0.203: v94.93,16.83 87.95,16.83 87.95,20.8 v87.79,20.8
SCK  (via drill 0.3)
  Top 0.203: CON_ISP.SCK 102.23,18.88 101.49,18.14 95.26,18.14 v94.93,17.82 | v92.23,17.75 83.72,17.75 83.12,17.15 81.53,17.15 81.12,17.55 32U4.9
  Bottom 0.203: v94.93,17.82 92.23,17.82 v92.23,17.75
SCL  (via drill 0.3)
  Top 0.203: v86.68,24.94 84.52,24.94 32U4.18
  Bottom 0.203: J1.SCL 122.1,9.83 122.09,9.83 119.87,9.83 | 119.87,9.83 119.86,9.84 | 119.87,9.83 119.86,9.84 | 119.86,9.84 119.86,18.57 111.28,27.15 86.68,27.15 v86.68,24.94
SDA  (via drill 0.3)
  Top 0.203: 84.52,25.72 32U4.19 84.52,25.72 | v87.47,26.35 86.36,26.35 86.36,25.72 84.52,25.72
  Bottom 0.203: J1.SDA 119.48,8.79 119.38,8.89 119.38,17.78 110.81,26.35 v87.47,26.35
USB_N
  Top 0.406: RUSB1.1 100.97,22.73 100.97,19.68 93.98,19.68 93.98,15.8 93.02,15.8 92.94,15.79 76.32,15.79 32U4.3
USB_P
  Top 0.406: RUSB2.1 100.01,24.89 100.01,20.48 93.19,20.48 93.19,16.51 77.12,16.51 32U4.4
USBC_N
  Top 0.406: X4.2 120.49,23.2 120.49,22.7 119.05,22.7 RUSB1.2
USBC_P
  Top 0.406: X4.3 120.49,24 120.49,24.92 119.06,24.92 RUSB2.2
VDD
  Top 0.813: IC1.1 107.31,12.36 CU7.1 108.56,12.36 108.56,15.69 109.2,15.69 | 111.91,15.71 D1.C | 111.91,15.71 111.75,15.71 D4.C | 109.2,15.69 110.47,15.69 111.91,15.69 111.91,15.71 | 109.2,15.69 D2.C
VUSB  (via drill 0.3)
  Top 0.203: v80.33,20.45 79.52,19.65 32U4.7
  Top 0.406: X4.1 121.12,22.4 120.2,21.48 118.52,21.48 | 118.52,21.48 v111.81,21.48 111.76,21.43 111.75,21.43 D4.A | CU9.2 118.52,21.48
  Bottom 0.203: v80.33,20.45 80.33,22.38 111.81,22.23 v111.81,21.48
XTAL1
  Top 0.406: 32U4.16 90.53,23.25 X2.P$1 90.53,22.41 RXT.1 93.69,22.09 CX2.2
Y3  (via drill 0.3)
  Top 0.203: v9.21,11.75 RK8.2
  Bottom 0.203: O3.3 9.21,11.8 v9.21,11.75
Y4  (via drill 0.3)
  Top 0.203: v8.57,4.76 RK10.2
  Bottom 0.203: O4.3 8.57,4.71 v8.57,4.76
Y5  (via drill 0.3)
  Top 0.203: v21.91,11.75 RK12.2
  Bottom 0.203: O5.3 21.91,11.8 v21.91,11.75
Y6  (via drill 0.3)
  Top 0.203: v21.27,4.76 RK14.2
  Bottom 0.203: O6.3 21.27,4.71 v21.27,4.76
Y7  (via drill 0.3)
  Top 0.203: v61.28,11.75 RK18.2
  Bottom 0.203: O7.3 61.28,11.8 v61.28,11.75
Y8  (via drill 0.3)
  Top 0.203: v60.64,4.76 RK20.2
  Bottom 0.203: O8.3 60.64,4.71 v60.64,4.76
Y9  (via drill 0.3)
  Top 0.203: v34.61,11.75 RK22.2
  Bottom 0.203: O9.3 34.61,11.8 v34.61,11.75
Y10  (via drill 0.3)
  Top 0.203: v33.97,4.76 RK24.2
  Bottom 0.203: O10.3 33.97,4.71 v33.97,4.76
Y11  (via drill 0.3)
  Top 0.203: v100.65,11.75 RK26.2
  Bottom 0.203: O11.3 100.65,11.8 v100.65,11.75
Y12  (via drill 0.3)
  Top 0.203: v100.01,4.76 RK28.2
  Bottom 0.203: O12.3 100.01,4.71 v100.01,4.76
Y13  (via drill 0.3)
  Top 0.203: v47.94,11.75 RK30.2
  Bottom 0.203: O13.3 47.94,11.8 v47.94,11.75
Y14  (via drill 0.3)
  Top 0.203: v47.31,4.6 RK32.2
  Bottom 0.203: O14.3 47.31,4.71 v47.31,4.6
Y15  (via drill 0.3)
  Top 0.203: v74.61,11.91 RK34.2
  Bottom 0.203: O15.3 74.61,11.8 v74.61,11.91
Y16  (via drill 0.3)
  Top 0.203: v73.98,4.76 RK36.2
  Bottom 0.203: O16.3 73.98,4.71 v73.98,4.76
Y19  (via drill 0.3)
  Top 0.203: v87.95,11.75 RK42.2
  Bottom 0.203: O19.3 87.95,11.8 v87.95,11.75
Y20  (via drill 0.3)
  Top 0.203: v87.31,4.76 RK44.2
  Bottom 0.203: O20.3 87.31,4.71 v87.31,4.76

### Text on the board
tNames: 3V3 | VDD | PID | D12
tValues: 1 | 3 | 5 | 7 | 9 | 11 | 13 | 15 | 2 | 4 | 6 | 8 | 10 | 12 | 14 | 16
bValues: 1 | 3 | 5 | 7 | 9 | 11 | 13 | 15 | 2 | 4 | 6 | 8 | 10 | 12 | 14 | 16